# Altium schematic sheet Gastroscopy-CutController_LED.SchDoc: LED Driver
size 279 x 215 mm; Date: not used; ApprovedBy: not used; CheckedBy: not used; Author: not used; DrawnBy: not used; Organization: not used; Address4: not used; SheetNumber: 5; SheetTotal: 8; Time: not used; ImagePath: not used; Application_BuildNumber: not used
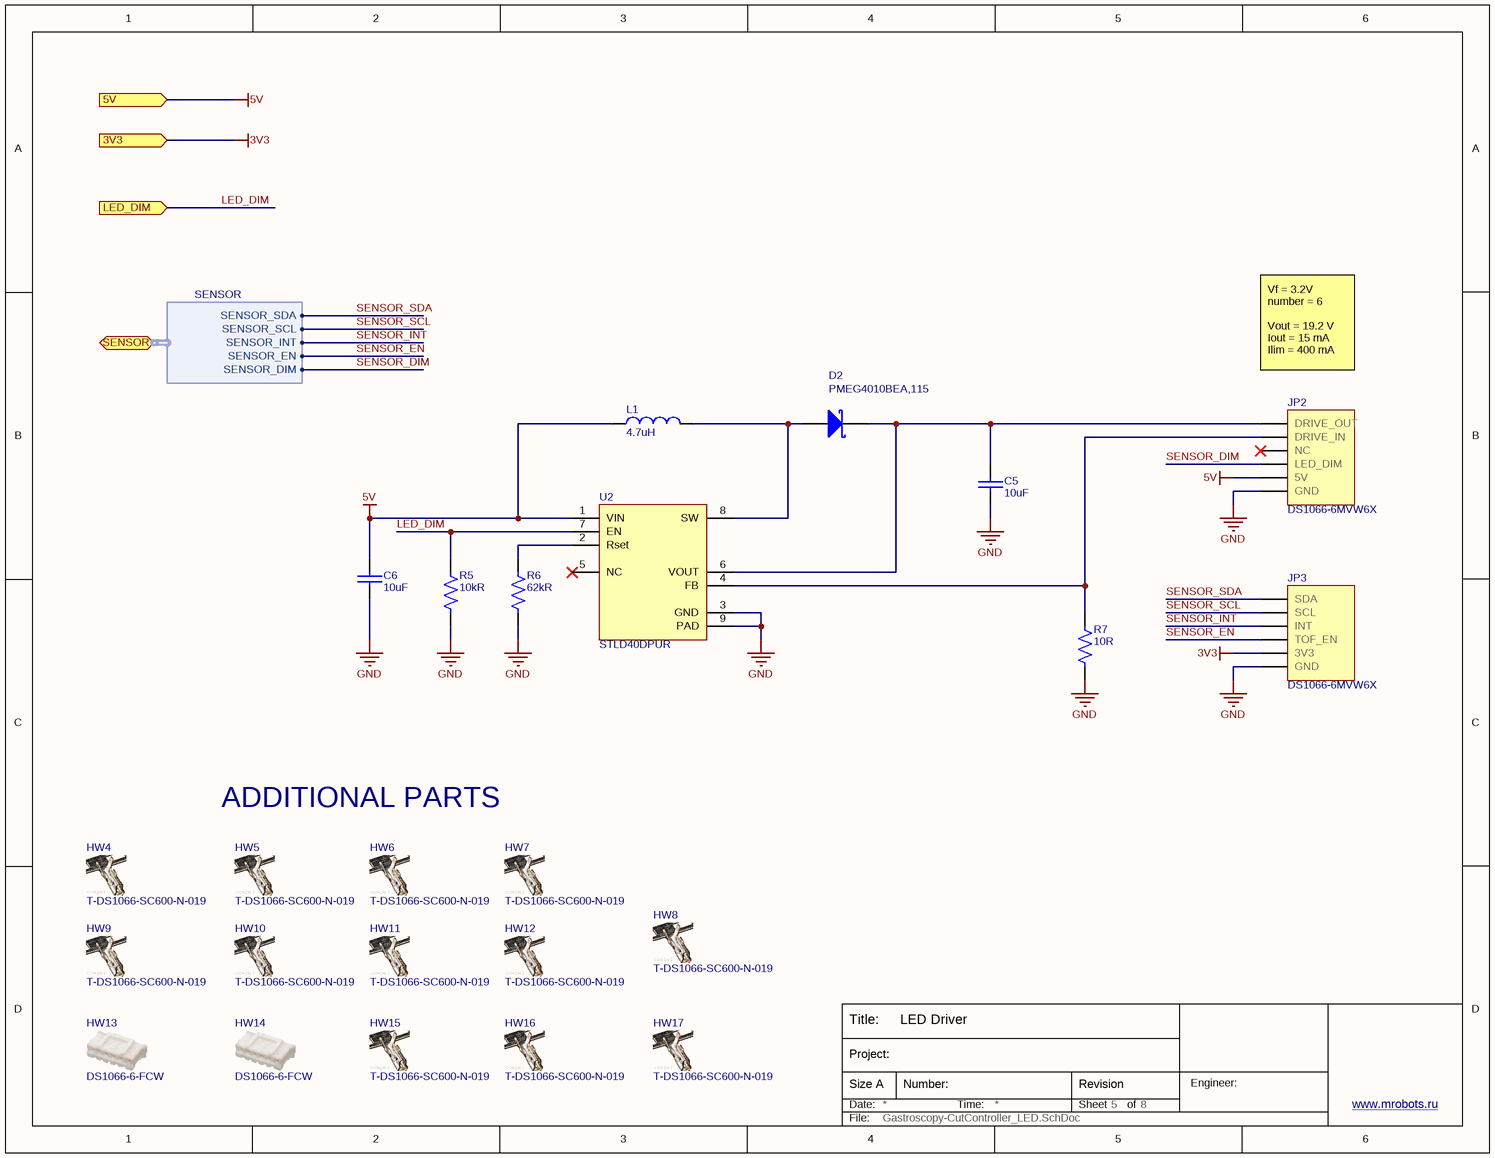
[diagram p0: Gastroscopy-CutController_LED.SchDoc]

## Parts
C5  10uF  [CAP_0805]
C6  10uF  [CAP_0805]
D2  PMEG4010BEA,115  [SOD-323]
HW4  T-DS1066-SC600-N-019  (mechanical)
HW5  T-DS1066-SC600-N-019  (mechanical)
HW6  T-DS1066-SC600-N-019  (mechanical)
HW7  T-DS1066-SC600-N-019  (mechanical)
HW8  T-DS1066-SC600-N-019  (mechanical)
HW9  T-DS1066-SC600-N-019  (mechanical)
HW10  T-DS1066-SC600-N-019  (mechanical)
HW11  T-DS1066-SC600-N-019  (mechanical)
HW12  T-DS1066-SC600-N-019  (mechanical)
HW13  DS1066-6-FCW  (mechanical)
HW14  DS1066-6-FCW  (mechanical)
HW15  T-DS1066-SC600-N-019  (mechanical)
HW16  T-DS1066-SC600-N-019  (mechanical)
HW17  T-DS1066-SC600-N-019  (mechanical)
JP2  DS1066-6MVW6X  [DS1066-6MVW6X]
JP3  DS1066-6MVW6X  [DS1066-6MVW6X]
L1  4.7uH  [NLC453232T-4R7K-PF]
R5  10kR  [RES_0603]
R6  62kR  [RES_0603]
R7  10R  [RES_0603]
U2  STLD40DPUR  [STLD40DPUR]

## Ports
3V3 (in), 5V (in), LED_DIM (in), SENSOR (bidir, harness SENSOR)

## Harnesses
SENSOR: SENSOR_SDA, SENSOR_SCL, SENSOR_INT, SENSOR_EN, SENSOR_DIM

## Nets
3V3: JP3.5 ; port 3V3
5V: C6.2 JP2.5 L1.1 U2.1(VIN) ; port 5V
GND: C5.1 C6.1 JP2.6 JP3.6 R5.2 R6.2 R7.2 U2.3(GND) U2.9(PAD)
LED_DIM: R5.1 U2.7(EN) ; port LED_DIM
SENSOR_DIM: JP2.4 ; port SENSOR.SENSOR_DIM
SENSOR_EN: JP3.4 ; port SENSOR.SENSOR_EN
SENSOR_INT: JP3.3 ; port SENSOR.SENSOR_INT
SENSOR_SCL: JP3.2 ; port SENSOR.SENSOR_SCL
SENSOR_SDA: JP3.1 ; port SENSOR.SENSOR_SDA
NetC5_2: C5.2 D2.1(K) JP2.1 U2.6(VOUT)
NetD2_2: D2.2(A) L1.2 U2.8(SW)
NetJP2_2: JP2.2 R7.1 U2.4(FB)
NetR6_1: R6.1 U2.2(Rset)

Not connected (* = marked no-connect by the designer): JP2 3*; U2 5(NC)*

## Notes on the sheet
- Vf = 3.2V
  number = 6
  Vout = 19.2 V
  Iout = 15 mA
  Ilim = 400 mA
- ADDITIONAL PARTS
- Title:
- Date:
- Size A
- Project:
- Number:
- Time:
- Sheet
- Revision
- of
- Engineer:
- www.mrobots.ru <http://mrobots.ru/>
- File:

## Library data of the parts
C5 C6 = CL21B106KOQNNNE: CAP CER 10UF 16V X7R 0805; Manufacturer 1: Samsung; Tolerance: 10%; Supplier 1: Avnet; Manufacturer Part Number 1: CL21B106KOQNNNE; RoHS: Yes; Category: Ceramic Capacitors; Stock 1: 1089000; Pricing 1: 2000=0,02892, 4000=0,02851, 8000=0,02768, 12000=0,02707, 16000=0,02603 (USD); Mount: Surface Mount; Case/Package: 0805; Case Code (Metric): 2012; Case Code (Imperial): 0805; Contact Plating: Tin; Min Operating Temperature: -55°C; Max Operating Temperature: 125°C; Packaging: Tape and Reel; Capacitance: 10uF; Voltage Rating: 16V; Package Quantity: 1; Dielectric: X7R; Series: CL; Construction: Flat; Voltage: 16V; Length: 2mm; Width: 0.049inch; Height: 1.25mm; Thickness: 0.055inch; Depth: 1.25mm; Radiation Hardening: No; RoHS Compliant: Yes; ComponentLink1URL: https://datasheet.ciiva.com/25794/cl21b106koqnnne-25794472.pdf?src-supplier=Digi-Key; ComponentLink1Description: https://datasheet.ciiva.com/25794/cl21b106koqnnne-25794472.pdf?src-supplier=Digi-Key; ComponentLink2URL: https://datasheet.ciiva.com/16428/cl21b106koqnnne-16428887.pdf?src-supplier=Future+Electronics; ComponentLink2Description: https://datasheet.ciiva.com/16428/cl21b106koqnnne-16428887.pdf?src-supplier=Future+Electronics; ComponentLink3URL: https://datasheet.ciiva.com/26920/getdatasheetpartid-355170-26920201.pdf?src-supplier=Verical; ComponentLink3Description: https://datasheet.ciiva.com/26920/getdatasheetpartid-355170-26920201.pdf?src-supplier=Verical; Supplier Part Number 1: CL21B106KOQNNNE
D2 = PMEG4010BEA,115: DIODE SCHOTTKY 40V 1A SOD323; Manufacturer: Nexperia; Supplier 1: RSComponents; Manufacturer Part Number: PMEG4010BEA,115; RoHS: Yes; Category: Rectifier Diodes; Stock 1: 163320; Pricing 1: 160=0,18400, 760=0,16200, 1500=0,13800 (GBP); RoHS Compliant: Yes; ComponentLink1URL: http://www.farnell.com/datasheets/689588.pdf?src-supplier=Farnell; ComponentLink1Description: http://www.farnell.com/datasheets/689588.pdf?src-supplier=Farnell; Supplier Part Number 1: 485644P
HW4-HW12 HW15-HW17 = T-DS1066-SC600-N-019: СONNECTOR DS1066; Manufacturer 1: Connfly electronic (Zhenqin); Manufacturer Part Number 1: T-DS1066-SC600-N-019
HW13 HW14 = DS1066-6-FCW: CONN SOCKET 6POS 2MM; Manufacturer 1: Connfly electronic (Zhenqin); Manufacturer Part Number 1: DS1066-6-FCW
JP2 = DS1066-6MVW6X: CONN PLUG 6POS 2MM; Manufacturer 1: Connfly electronic (Zhenqin); Contact_1: DRIVE_OUT; Contact_2: DRIVE_IN; Contact_3: NC; Contact_4: LED_DIM; Contact_5: 5V; Contact_6: GND; Manufacturer Part Number 1: DS1066-6MVW6X
JP3 = DS1066-6MVW6X: CONN PLUG 6POS 2MM; Manufacturer 1: Connfly electronic (Zhenqin); Contact_1: SDA; Contact_2: SCL; Contact_3: INT; Contact_4: TOF_EN; Contact_5: 3V3; Contact_6: GND; Manufacturer Part Number 1: DS1066-6MVW6X
L1 = NLC453232T-4R7K-PF: FIXED IND 4.7UH 650MA 270MOHM SM; Manufacturer: TDK; Core Material: Ferrite; Tolerance: 10%; Shielding: Unshielded; Q Factor: 10; Self Resonant Frequency: 35MHz; Resistance: 270mR; Test Frequency: 7.96MHz; Inductor Type: POWER; Supplier 1: Arrow Electronics; Manufacturer Part Number: NLC453232T-4R7K-PF; RoHS: Yes; Category: Fixed Inductors; Stock 1: 6500; Pricing 1: 500=0,20930, 1000=0,16890 (USD); Mount: Surface Mount; Case/Package: 1812; Number of Pins: 2; Case Code (Metric): 4532; Case Code (Imperial): 1812; Weight: 180mg; Min Operating Temperature: -40°C; Max Operating Temperature: 105°C; Package Quantity: 500; Current Rating: 650mA; Packaging: Tape and Reel; Inductance Tolerance: 10%; Resistor Type: Wirewound; Inductance: 4.7uH; DC Resistance (DCR): 270mR; Max DC Current: 650mA; Termination: SMD/SMT; DC Current: 650mA; Series: NLC; Rated Current-Max: 650mA; Length: 4.8mm; Width: 0.126inch; Height: 3.2mm; Height - Seated (Max): 0.134inch; Depth: 3.4mm; Radiation Hardening: No; Reach SVHC Compliant: Yes; Military Standard: Not; Lead Free: Lead Free; RoHS Compliant: Yes; ComponentLink1URL: https://datasheet.ciiva.com/15160/getdatasheetpartid-200345-15160695.pdf?src-supplier=Verical; ComponentLink1Description: https://datasheet.ciiva.com/15160/getdatasheetpartid-200345-15160695.pdf?src-supplier=Verical; ComponentLink2URL: https://datasheet.ciiva.com/49516/1871457-49516870.pdf?src-supplier=Jameco; ComponentLink2Description: https://datasheet.ciiva.com/49516/1871457-49516870.pdf?src-supplier=Jameco; ComponentLink3URL: https://datasheet.ciiva.com/22622/1505805-22622665.pdf?src-supplier=Element14; ComponentLink3Description: https://datasheet.ciiva.com/22622/1505805-22622665.pdf?src-supplier=Element14; ComponentLink4URL: https://datasheet.ciiva.com/15987/e531-nlc4532-15987565.pdf?src-supplier=Onlinecomponents.com; ComponentLink4Description: https://datasheet.ciiva.com/15987/e531-nlc4532-15987565.pdf?src-supplier=Onlinecomponents.com; Supplier Part Number 1: NLC453232T-4R7K-PF
R5 = RC0603FR-0710KL: RES 10K OHM 1% 1/10W 0603; Manufacturer 1: Yageo; Voltage Rating (DC): 50V; Temperature Coefficient: 100ppm/°C; Power Rating: 100mW; Voltage Rating: 75V; Supplier 1: Arrow Electronics; RoHS: Yes; Category: Chip SMD Resistors; Stock 1: 4950000; Pricing 1: 5000=0,00240 (USD); Case/Package: 0603; Number of Pins: 2; Case Code (Imperial): 0603; Case Code (Metric): 1608; Weight: 7.1E-05oz; Size Code: 0603; Min Operating Temperature: -55°C; Max Operating Temperature: 155°C; Packaging: Tape and Reel; Resistance: 10kR; Tolerance: 1%; Resistor Type: Thick Film; Termination: SMD/SMT; Features: Moisture Resistant; Series: RC; Max Power Dissipation: 100mW; Number of Terminations: 2; Resistance Tolerance: 1%; Construction: Rectangular; Length: 1.6mm; Width: 0.8mm; Height: 0.45mm; Depth: 0.8mm; Lead Pitch: 0.3mm; REACH SVHC: Unknown; Lead Free: Lead Free; Military Standard: Not; RoHS Compliant: Yes; ComponentLink1URL: https://datasheet.ciiva.com/7660/38590-7660789.pdf?src-supplier=Element14; ComponentLink1Description: https://datasheet.ciiva.com/7660/38590-7660789.pdf?src-supplier=Element14; ComponentLink2URL: https://datasheet.ciiva.com/7983/443971-7983596.pdf?src-supplier=Element14; ComponentLink2Description: https://datasheet.ciiva.com/7983/443971-7983596.pdf?src-supplier=Element14; ComponentLink3URL: https://datasheet.ciiva.com/22747/443971-22747519.pdf?src-supplier=Element14; ComponentLink3Description: https://datasheet.ciiva.com/22747/443971-22747519.pdf?src-supplier=Element14; ComponentLink4URL: https://datasheet.ciiva.com/46440/1868787-46440891.pdf?src-supplier=Element14; ComponentLink4Description: https://datasheet.ciiva.com/46440/1868787-46440891.pdf?src-supplier=Element14; ComponentLink5URL: https://datasheet.ciiva.com/7746/1738695-7746239.pdf?src-supplier=Element14; ComponentLink5Description: https://datasheet.ciiva.com/7746/1738695-7746239.pdf?src-supplier=Element14; Supplier Part Number 1: RC0603FR-0710KL; Manufacturer Part Number 1: RC0603FR-0710KL
R6 = RC0603FR-0762KL: RES 62K OHM 1% 1/10W 0603; Manufacturer: Yageo; Power Rating: 100mW; Voltage Rating: 50V; Temperature Coefficient: 100ppm/°C; Supplier 1: Avnet; Manufacturer Part Number: RC0603FR-0762KL; RoHS: Yes; Category: Chip SMD Resistors; Stock 1: 75000; Pricing 1: 5000=0,00133, 10000=0,00131, 20000=0,00127 (USD); Case/Package: 0603; Case Code (Metric): 1608; Case Code (Imperial): 0603; Size Code: 0603; Min Operating Temperature: -55°C; Max Operating Temperature: 155°C; Package Quantity: 1; Resistance: 62kR; Tolerance: 1%; Packaging: Tape and Reel; Resistor Type: Thick Film; Number of Terminations: 2; Termination: SMD/SMT; Max Power Dissipation: 100mW; Voltage Rating (DC): 50V; Features: Moisture Resistant; Series: RC; Construction: Rectangular; Length: 1.6mm; Width: 0.031inch; Height: 0.022inch; Depth: 0.8mm; Military Standard: Not; Lead Free: Lead Free; RoHS Compliant: Yes; ComponentLink1URL: https://datasheet.ciiva.com/2454/pyu-r-int-thick-7-2454127.pdf?src-supplier=Digi-Key; ComponentLink1Description: https://datasheet.ciiva.com/2454/pyu-r-int-thick-7-2454127.pdf?src-supplier=Digi-Key; ComponentLink2URL: https://datasheet.ciiva.com/2454/pyu-r-int-thick-7-2454128.pdf?src-supplier=Digi-Key; ComponentLink2Description: https://datasheet.ciiva.com/2454/pyu-r-int-thick-7-2454128.pdf?src-supplier=Digi-Key; ComponentLink3URL: https://datasheet.ciiva.com/2454/pyu-r-int-thick-7-2454126.pdf?src-supplier=Digi-Key; ComponentLink3Description: https://datasheet.ciiva.com/2454/pyu-r-int-thick-7-2454126.pdf?src-supplier=Digi-Key; ComponentLink4URL: https://datasheet.ciiva.com/12558/rc0603-272842-12558365.pdf?src-supplier=Mouser; ComponentLink4Description: https://datasheet.ciiva.com/12558/rc0603-272842-12558365.pdf?src-supplier=Mouser; Supplier Part Number 1: RC0603FR-0762KL
R7 = RC0603FR-0710RL: RES 10 OHM 1% 1/10W 0603; Manufacturer 1: Yageo; Voltage Rating (DC): 50V; Temperature Coefficient: 200ppm/°C; Max Power Dissipation: 100mW; Supplier 1: RSComponents; RoHS: Yes; Category: Chip SMD Resistors; Stock 1: 6700; Pricing 1: 100=0,01600, 1000=0,01500, 2500=0,01400, 5000=0,01300, 10000=0,01200 (GBP); Case/Package: 0603; Number of Pins: 2; Case Code (Imperial): 0603; Case Code (Metric): 1608; Contact Plating: Tin,Matte; Size Code: 0603; Min Operating Temperature: -55°C; Max Operating Temperature: 155°C; Packaging: Tape and Reel; Resistance: 10R; Tolerance: 1%; Resistor Type: Thick Film; Features: Moisture Resistant; Series: RC; Number of Terminations: 2; Power Rating: 100mW; Voltage Rating: 50V; Termination: SMD/SMT; Resistance Tolerance: 1%; Construction: Rectangular; Technology: THICK FILM; Length: 1.6mm; Width: 0.8mm; Height: 0.45mm; Depth: 0.8mm; Radiation Hardening: No; Lead Free: Lead Free; RoHS Compliant: Yes; Reach SVHC Compliant: Yes; Military Standard: Not; ComponentLink1URL: https://datasheet.ciiva.com/11808/0900766b80f96399-11808140.pdf?src-supplier=RSComponents; ComponentLink1Description: https://datasheet.ciiva.com/11808/0900766b80f96399-11808140.pdf?src-supplier=RSComponents; ComponentLink2URL: https://datasheet.ciiva.com/7746/443971-7746245.pdf?src-supplier=Element14; ComponentLink2Description: https://datasheet.ciiva.com/7746/443971-7746245.pdf?src-supplier=Element14; ComponentLink3URL: https://datasheet.ciiva.com/8891/pyu-rc0603-51-rohs-l-4-8891285.pdf?src-supplier=Avnet; ComponentLink3Description: https://datasheet.ciiva.com/8891/pyu-rc0603-51-rohs-l-4-8891285.pdf?src-supplier=Avnet; Supplier Part Number 1: 1995445; Manufacturer Part Number 1: RC0603FR-0710RL
U2 = STLD40DPUR: IC LED DRVR RGLTR PWM 20MA 8QFN; Manufacturer 1: STMicroelectronics; Min Input Voltage: 3V; Max Input Voltage: 5.5V; Number of Outputs: 1; Output Voltage: 37V; Efficiency: 80%; Max Supply Current: 1.2mA; Topology: Boost; Output Type: Adjustable; Supplier 1: Arrow Electronics; Manufacturer Part Number 1: STLD40DPUR; RoHS: Yes; Category: Power Supply Modules; Stock 1: 11940; Pricing 1: 1=2,55430, 10=2,53990, 25=2,52560, 100=2,51140, 250=2,49700, 500=2,48270, 1000=2,46850, 3000=2,45410, 6000=2,43980 (USD); Mount: Surface Mount; Case/Package: QFN; Number of Pins: 8; Min Operating Temperature: -40°C; Max Operating Temperature: 85°C; Output Current: 20mA; Packaging: Tape and Reel; Package Quantity: 1; Operating Supply Voltage: 5.5V; Output Current per Channel: 20mA; Series: -; Radiation Hardening: No; Reach SVHC Compliant: No; Lead Free: Lead Free; RoHS Compliant: Yes; ComponentLink1URL: https://datasheet.ciiva.com/16491/cd00098098-16491024.pdf?src-supplier=Future+Electronics; ComponentLink1Description: https://datasheet.ciiva.com/16491/cd00098098-16491024.pdf?src-supplier=Future+Electronics; ComponentLink2URL: https://datasheet.ciiva.com/41457/001186075-da-01-en-ic-led-driver-white-stld40dpur-qfn-8-stm-41457402.pdf?src-supplier=Conrad; ComponentLink2Description: https://datasheet.ciiva.com/41457/001186075-da-01-en-ic-led-driver-white-stld40dpur-qfn-8-stm-41457402.pdf?src-supplier=Conrad; ComponentLink3URL: https://datasheet.ciiva.com/1945/cd00098098-1945372.pdf?src-supplier=Digi-Key; ComponentLink3Description: https://datasheet.ciiva.com/1945/cd00098098-1945372.pdf?src-supplier=Digi-Key; ComponentLink4URL: https://datasheet.ciiva.com/1945/cd00098098-1945373.pdf?src-supplier=Digi-Key; ComponentLink4Description: https://datasheet.ciiva.com/1945/cd00098098-1945373.pdf?src-supplier=Digi-Key; ComponentLink5URL: https://datasheet.ciiva.com/1945/cd00098098-1945374.pdf?src-supplier=Digi-Key; ComponentLink5Description: https://datasheet.ciiva.com/1945/cd00098098-1945374.pdf?src-supplier=Digi-Key; Supplier Part Number 1: STLD40DPUR